# EAGLE design mainboard 1.3 (EAGLE 6.1)
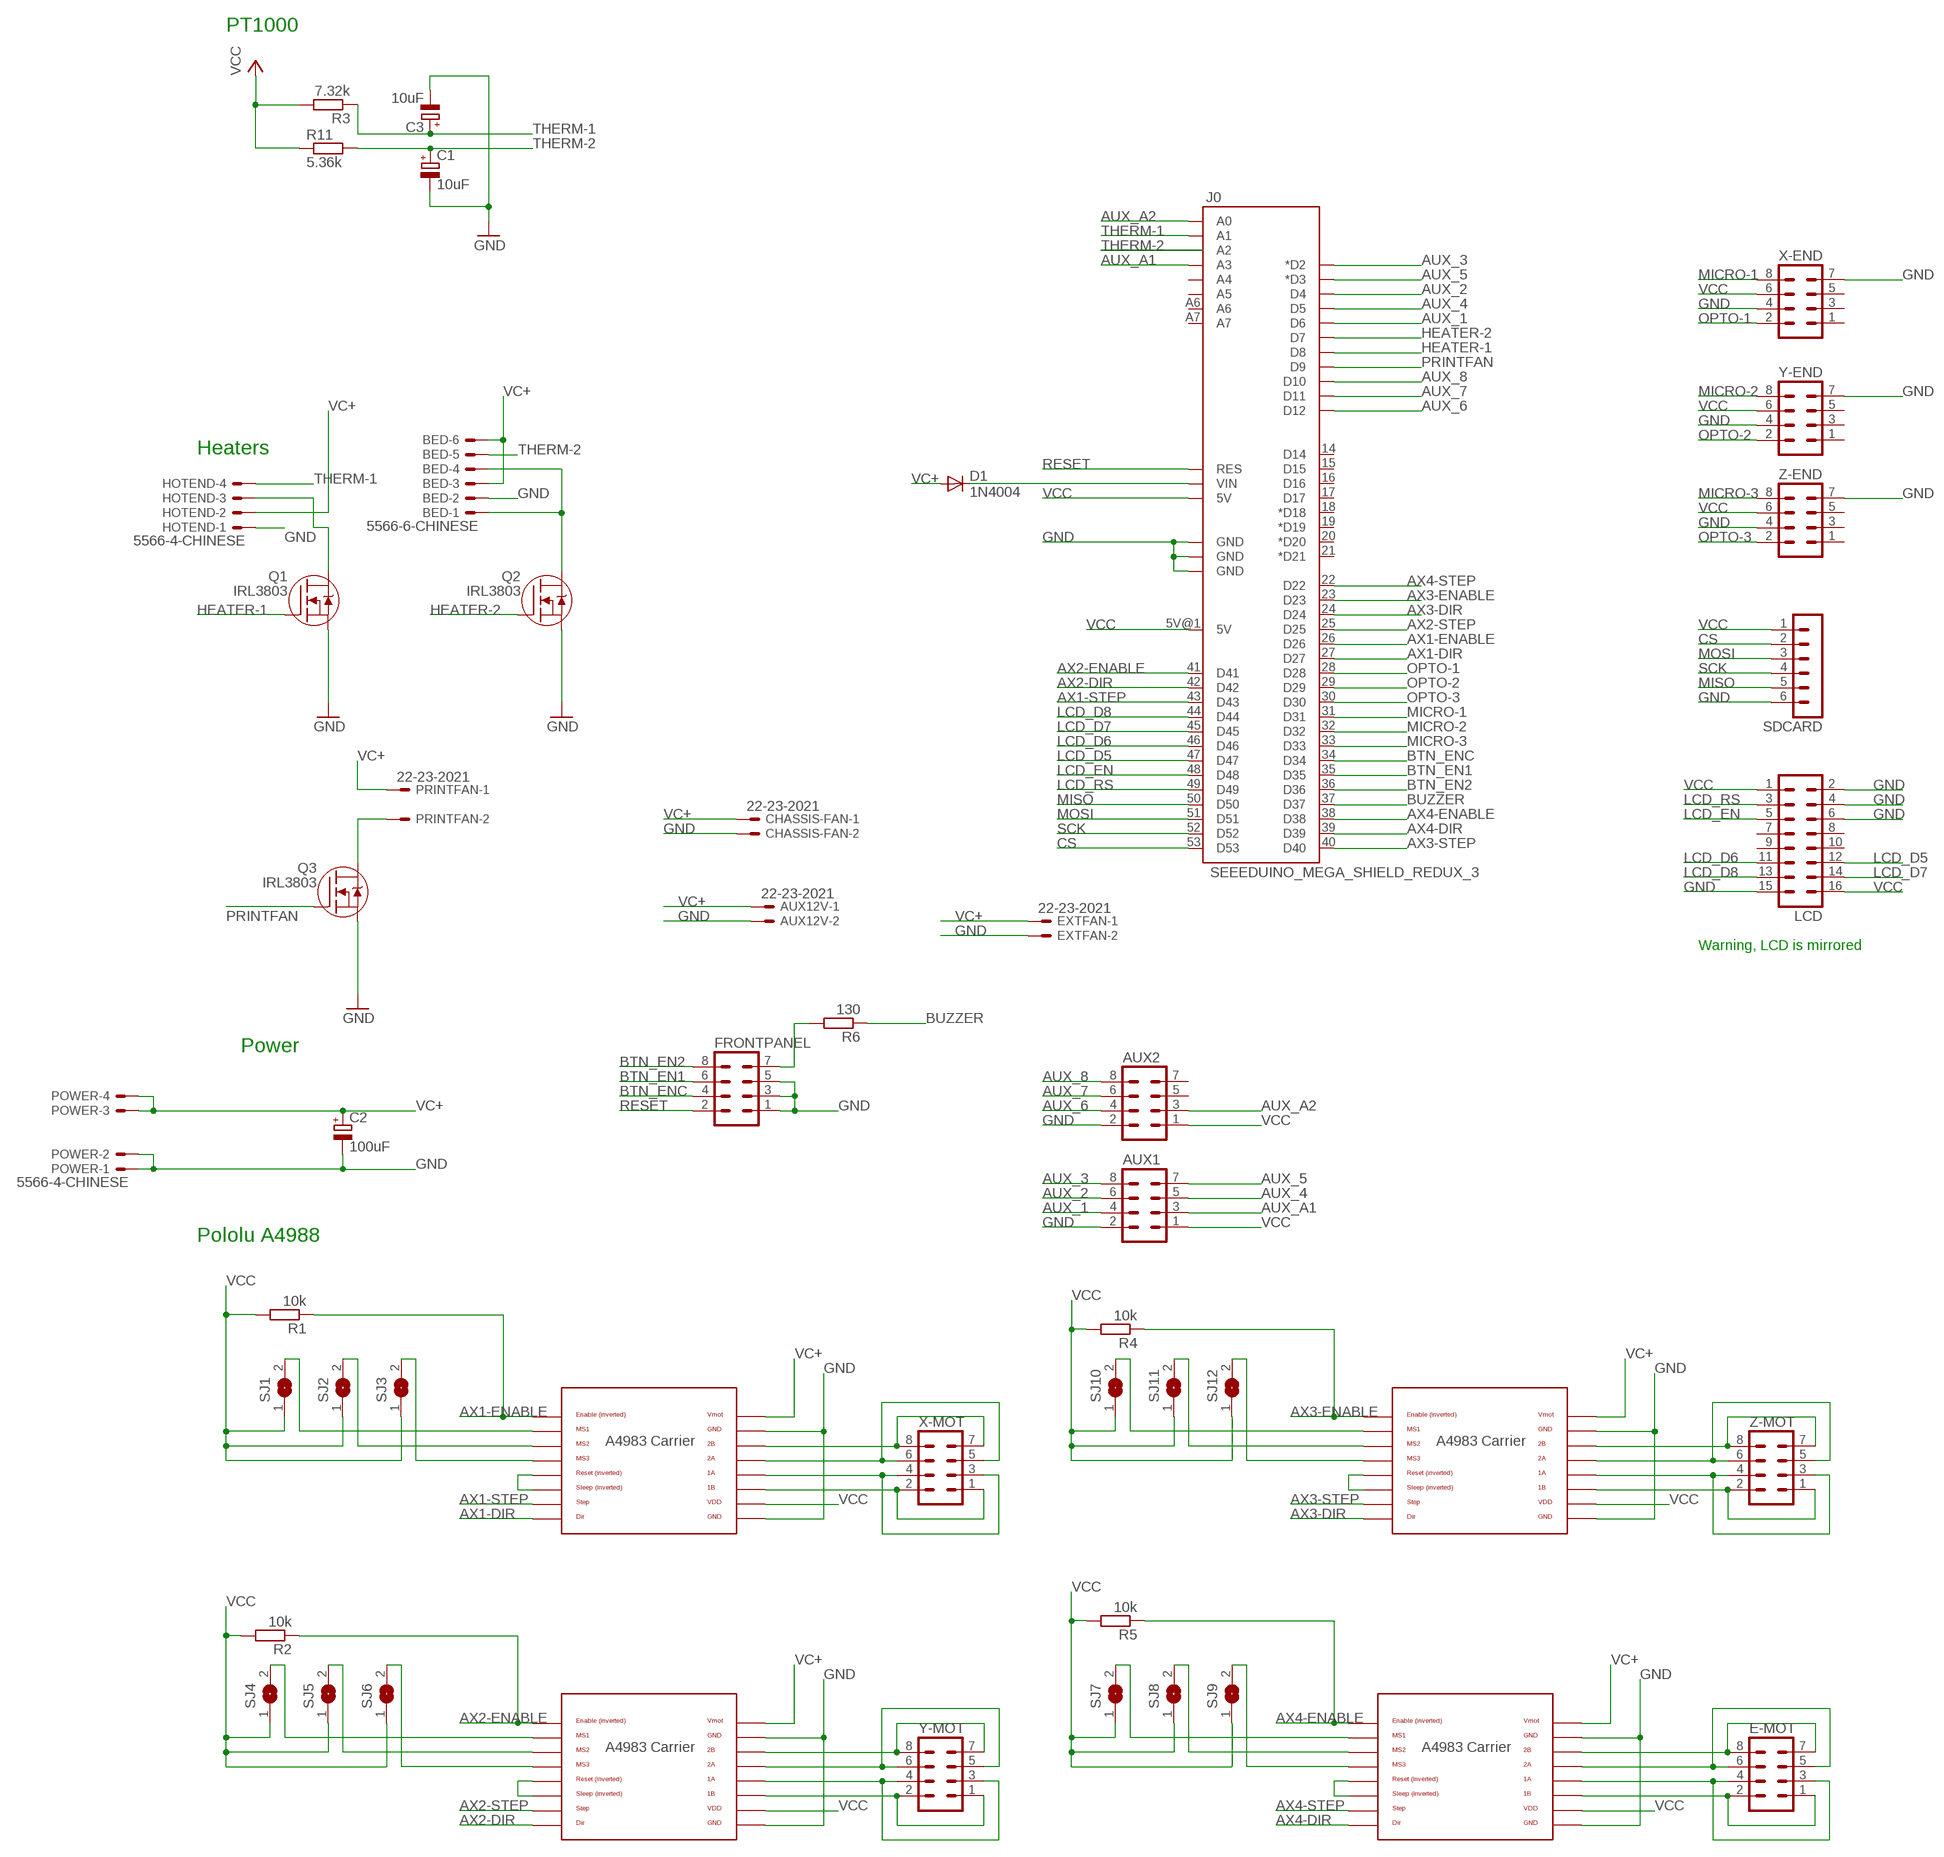
[diagram p0: schematic, sheet 1]

## Parts
AUX1  MA04-2-HOLES  [MA04-2]
AUX2  MA04-2  [MA04-2@1]
AUX12V  22-23-2021  [22-23-2021]
BED  5566-6-CHINESE  [5566-6-CHINESE]
C1  10uF  CPOL-EUE2.5-6  [E2,5-6]
C2  100uF  CPOL-EUE2.5-6  [E2,5-6]
C3  10uF  CPOL-EUE2.5-6  [E2,5-6]
CHASSIS-FAN  22-23-2021  [22-23-2021]
D1  1N4004  [DO41-10]
E-AXIS  POLOLU_A4983CARRIER  [A4983CARRIER]
E-MOT  MA04-2  [MA04-2@1]
EXTFAN  22-23-2021  [22-23-2021]
FRONTPANEL  MA04-2  [MA04-2@1]
HOTEND  5566-4-CHINESE  [5566-4-CHINESE]
J0  SEEEDUINO_MEGA_SHIELD_REDUX_3  [SEEEDUINO_MEGA_SHIELD_REDUX_3]
LCD  MA08-2  [MA08-2]
POWER  5566-4-CHINESE  [5566-4-CHINESE]
PRINTFAN  22-23-2021  [22-23-2021]
Q1  IRL3803  [TO220AB]
Q2  IRL3803  [TO220AB]
Q3  IRL3803  [TO220AB]
R1  10k  R-EU_0204/7  [0204/7]
R2  10k  R-EU_0204/7  [0204/7]
R3  7.32k  R-EU_0204/7  [0204/7]
R4  10k  R-EU_0204/7  [0204/7]
R5  10k  R-EU_0204/7  [0204/7]
R6  130  R-EU_0204/7  [0204/7]
R11  5.36k  R-EU_0204/7  [0204/7]
SDCARD  MA06-1  [MA06-1]
SJ1  SJ  [SJ]
SJ2  SJ  [SJ]
SJ3  SJ  [SJ]
SJ4  SJ  [SJ]
SJ5  SJ  [SJ]
SJ6  SJ  [SJ]
SJ7  SJ  [SJ]
SJ8  SJ  [SJ]
SJ9  SJ  [SJ]
SJ10  SJ  [SJ]
SJ11  SJ  [SJ]
SJ12  SJ  [SJ]
X-AXIS  POLOLU_A4983CARRIER  [A4983CARRIER]
X-END  MA04-2  [MA04-2@1]
X-MOT  MA04-2  [MA04-2@1]
Y-AXIS  POLOLU_A4983CARRIER  [A4983CARRIER]
Y-END  MA04-2  [MA04-2@1]
Y-MOT  MA04-2  [MA04-2@1]
Z-AXIS  POLOLU_A4983CARRIER  [A4983CARRIER]
Z-END  MA04-2  [MA04-2@1]
Z-MOT  MA04-2  [MA04-2@1]

## Nets
AUX_1: AUX1.4 J0.6(D6)
AUX_2: AUX1.6 J0.4(D4)
AUX_3: AUX1.8 J0.2(*D2)
AUX_4: AUX1.5 J0.5(D5)
AUX_5: AUX1.7 J0.3(*D3)
AUX_6: AUX2.4 J0.12(D12)
AUX_7: AUX2.6 J0.11(D11)
AUX_8: AUX2.8 J0.10(D10)
AUX_A1: AUX1.3 J0.A3
AUX_A2: AUX2.3 J0.A0
AX1-DIR: J0.27(D27) X-AXIS.DIR
AX1-ENABLE: J0.26(D26) R1.1 X-AXIS.EN
AX1-STEP: J0.43(D43) X-AXIS.STEP
AX2-DIR: J0.42(D42) Y-AXIS.DIR
AX2-ENABLE: J0.41(D41) R2.1 Y-AXIS.EN
AX2-STEP: J0.25(D25) Y-AXIS.STEP
AX3-DIR: J0.24(D24) Z-AXIS.DIR
AX3-ENABLE: J0.23(D23) R4.1 Z-AXIS.EN
AX3-STEP: J0.40(D40) Z-AXIS.STEP
AX4-DIR: E-AXIS.DIR J0.39(D39)
AX4-ENABLE: E-AXIS.EN J0.38(D38) R5.1
AX4-STEP: E-AXIS.STEP J0.22(D22)
BTN_EN1: FRONTPANEL.6 J0.35(D35)
BTN_EN2: FRONTPANEL.8 J0.36(D36)
BTN_ENC: FRONTPANEL.4 J0.34(D34)
BUZZER: J0.37(D37) R6.1
CS: J0.53(D53) SDCARD.2
GND [GND]: AUX1.2 AUX2.2 AUX12V.2 BED.2 C1.- C2.- C3.- CHASSIS-FAN.2 E-AXIS.GND E-AXIS.GND@0(GND) EXTFAN.2 FRONTPANEL.1 FRONTPANEL.3 FRONTPANEL.5 HOTEND.1 J0.GND@0(GND) J0.GND@1(GND) J0.GND@2(GND) LCD.2 LCD.4 LCD.6 LCD.15 POWER.1 POWER.2 Q1.S Q2.S Q3.S SDCARD.6 X-AXIS.GND X-AXIS.GND@0(GND) X-END.4 X-END.7 Y-AXIS.GND Y-AXIS.GND@0(GND) Y-END.4 Y-END.7 Z-AXIS.GND Z-AXIS.GND@0(GND) Z-END.4 Z-END.7
HEATER-1: J0.8(D8) Q1.G
HEATER-2: J0.7(D7) Q2.G
LCD_D5: J0.47(D47) LCD.12
LCD_D6: J0.46(D46) LCD.11
LCD_D7: J0.45(D45) LCD.14
LCD_D8: J0.44(D44) LCD.13
LCD_EN: J0.48(D48) LCD.5
LCD_RS: J0.49(D49) LCD.3
MICRO-1: J0.31(D31) X-END.8
MICRO-2: J0.32(D32) Y-END.8
MICRO-3: J0.33(D33) Z-END.8
MISO: J0.50(D50) SDCARD.5
MOSI: J0.51(D51) SDCARD.3
N$1 [Heavy GND]: BED.1 BED.4 Q2.D
N$2: FRONTPANEL.7 R6.2
N$3: X-AXIS.RST X-AXIS.SLP(SLEEP)
N$4: SJ3.2 X-AXIS.MS3
N$5: SJ2.2 X-AXIS.MS2
N$6: SJ1.2 X-AXIS.MS1
N$7 [Motor 12V]: X-AXIS.2B X-MOT.7 X-MOT.8
N$8 [Motor 12V]: X-AXIS.2A X-MOT.5 X-MOT.6
N$9 [Motor 12V]: X-AXIS.1A X-MOT.3 X-MOT.4
N$10 [Motor 12V]: X-AXIS.1B X-MOT.1 X-MOT.2
N$11 [GND]: PRINTFAN.2 Q3.D
N$12: Z-AXIS.RST Z-AXIS.SLP(SLEEP)
N$13 [+12V]: D1.C J0.VIN
N$16: SJ12.2 Z-AXIS.MS3
N$17: SJ11.2 Z-AXIS.MS2
N$18: SJ10.2 Z-AXIS.MS1
N$19 [Motor 12V]: Z-AXIS.2B Z-MOT.7 Z-MOT.8
N$20 [Motor 12V]: Z-AXIS.2A Z-MOT.5 Z-MOT.6
N$21 [Motor 12V]: Z-AXIS.1A Z-MOT.3 Z-MOT.4
N$22 [Motor 12V]: Z-AXIS.1B Z-MOT.1 Z-MOT.2
N$24: Y-AXIS.RST Y-AXIS.SLP(SLEEP)
N$25: SJ6.2 Y-AXIS.MS3
N$26: SJ5.2 Y-AXIS.MS2
N$27: SJ4.2 Y-AXIS.MS1
N$28 [Motor 12V]: Y-AXIS.2B Y-MOT.7 Y-MOT.8
N$29 [Motor 12V]: Y-AXIS.2A Y-MOT.5 Y-MOT.6
N$30 [Motor 12V]: Y-AXIS.1A Y-MOT.3 Y-MOT.4
N$31 [Motor 12V]: Y-AXIS.1B Y-MOT.1 Y-MOT.2
N$33: E-AXIS.RST E-AXIS.SLP(SLEEP)
N$34: E-AXIS.MS3 SJ9.2
N$35: E-AXIS.MS2 SJ8.2
N$36: E-AXIS.MS1 SJ7.2
N$37 [Motor 12V]: E-AXIS.2B E-MOT.7 E-MOT.8
N$38 [Motor 12V]: E-AXIS.2A E-MOT.5 E-MOT.6
N$39 [Motor 12V]: E-AXIS.1A E-MOT.3 E-MOT.4
N$40 [Motor 12V]: E-AXIS.1B E-MOT.1 E-MOT.2
N$65 [Heavy GND]: HOTEND.3 Q1.D
OPTO-1: J0.28(D28) X-END.2
OPTO-2: J0.29(D29) Y-END.2
OPTO-3: J0.30(D30) Z-END.2
PRINTFAN: J0.9(D9) Q3.G
RESET: FRONTPANEL.2 J0.RST(RES)
SCK: J0.52(D52) SDCARD.4
THERM-1: C3.+ HOTEND.4 J0.A1 R3.1
THERM-2: BED.5 C1.+ J0.A2 R11.2
VC+ [+12V]: AUX12V.1 BED.3 BED.6 C2.+ CHASSIS-FAN.1 D1.A E-AXIS.VMOT EXTFAN.1 HOTEND.2 POWER.3 POWER.4 PRINTFAN.1 X-AXIS.VMOT Y-AXIS.VMOT Z-AXIS.VMOT
VCC [+5V]: AUX1.1 AUX2.1 E-AXIS.VDD J0.5V@0(5V) J0.5V@1(5V) LCD.1 LCD.16 R1.2 R2.2 R3.2 R4.2 R5.2 R11.1 SDCARD.1 SJ1.1 SJ2.1 SJ3.1 SJ4.1 SJ5.1 SJ6.1 SJ7.1 SJ8.1 SJ9.1 SJ10.1 SJ11.1 SJ12.1 X-AXIS.VDD X-END.6 Y-AXIS.VDD Y-END.6 Z-AXIS.VDD Z-END.6
Unconnected: AUX2.5 AUX2.7 J0.14(D14) J0.15(D15) J0.16(D16) J0.17(D17) J0.18(*D18) J0.19(*D19) J0.20(*D20) J0.21(*D21) J0.A4 J0.A5 J0.A6 J0.A7 LCD.7 LCD.8 LCD.9 LCD.10 X-END.1 X-END.3 X-END.5 Y-END.1 Y-END.3 Y-END.5 Z-END.1 Z-END.3 Z-END.5

## Notes on the sheet
- PT1000
- Heaters
- Warning, LCD is mirrored
- Power
- Pololu A4988

## Library data of the parts
AUX1 = local-lib:MA04-2-HOLES: PIN HEADER; OC_FARNELL: unknown; OC_NEWARK: unknown
AUX2 E-MOT FRONTPANEL X-END X-MOT Y-END Y-MOT Z-END Z-MOT = con-lstb:MA04-2: PIN HEADER; OC_FARNELL: unknown; OC_NEWARK: unknown
AUX12V CHASSIS-FAN EXTFAN PRINTFAN = con-molex:22-23-2021: .100" (2.54mm) Center Header - 2 Pin; MF: MOLEX; MPN: 22-23-2021; OC_FARNELL: 1462926; OC_NEWARK: 25C3832
BED = local-lib:5566-6-CHINESE: Mini FIT connector 6 pol Source: http://www.molex.com; MPN: 95566-61002; OC_FARNELL: unknown; OC_NEWARK: 22K8620
C1-C3 = rcl:CPOL-EU: POLARIZED CAPACITOR, European symbol
D1 = diode:1N4004: DIODE general purpose rectifier, 1 A
E-AXIS X-AXIS Y-AXIS Z-AXIS = RepRapjr:POLOLU_A4983CARRIER
HOTEND POWER = local-lib:5566-4-CHINESE: Mini FIT connector 4 pol Source: http://www.molex.com
J0 = local-lib:SEEEDUINO_MEGA_SHIELD_REDUX_3
LCD = con-lstb:MA08-2: PIN HEADER; OC_FARNELL: unknown; OC_NEWARK: unknown
Q1-Q3 = local-lib:IRL3803
R1-R6 R11 = rcl:R-EU_: RESISTOR, European symbol
SDCARD = con-lstb:MA06-1: PIN HEADER; OC_FARNELL: unknown; OC_NEWARK: unknown
SJ1-SJ12 = jumper:SJ: SMD solder JUMPER

## Net classes
0 default: width 0.24 mm
1 +5V: width 0.406 mm
2 +12V: width 0.813 mm
3 GND: width 0.406 mm
4 Motor 12V: width 0.813 mm
5 Heavy GND: width 2.54 mm

## Board
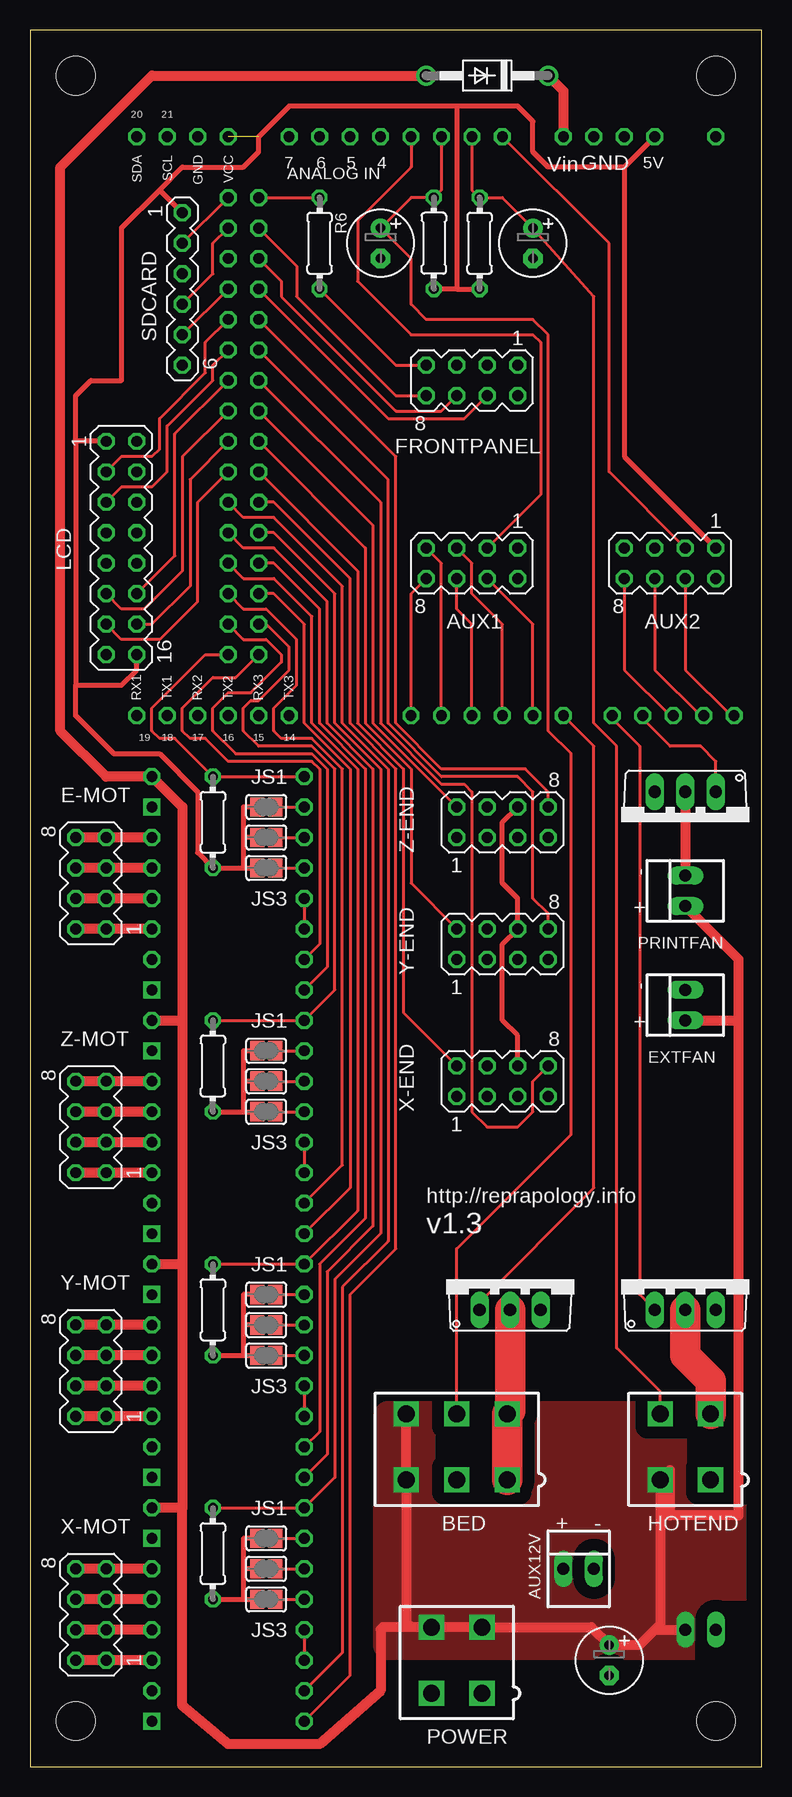
[diagram p1: board, top side]
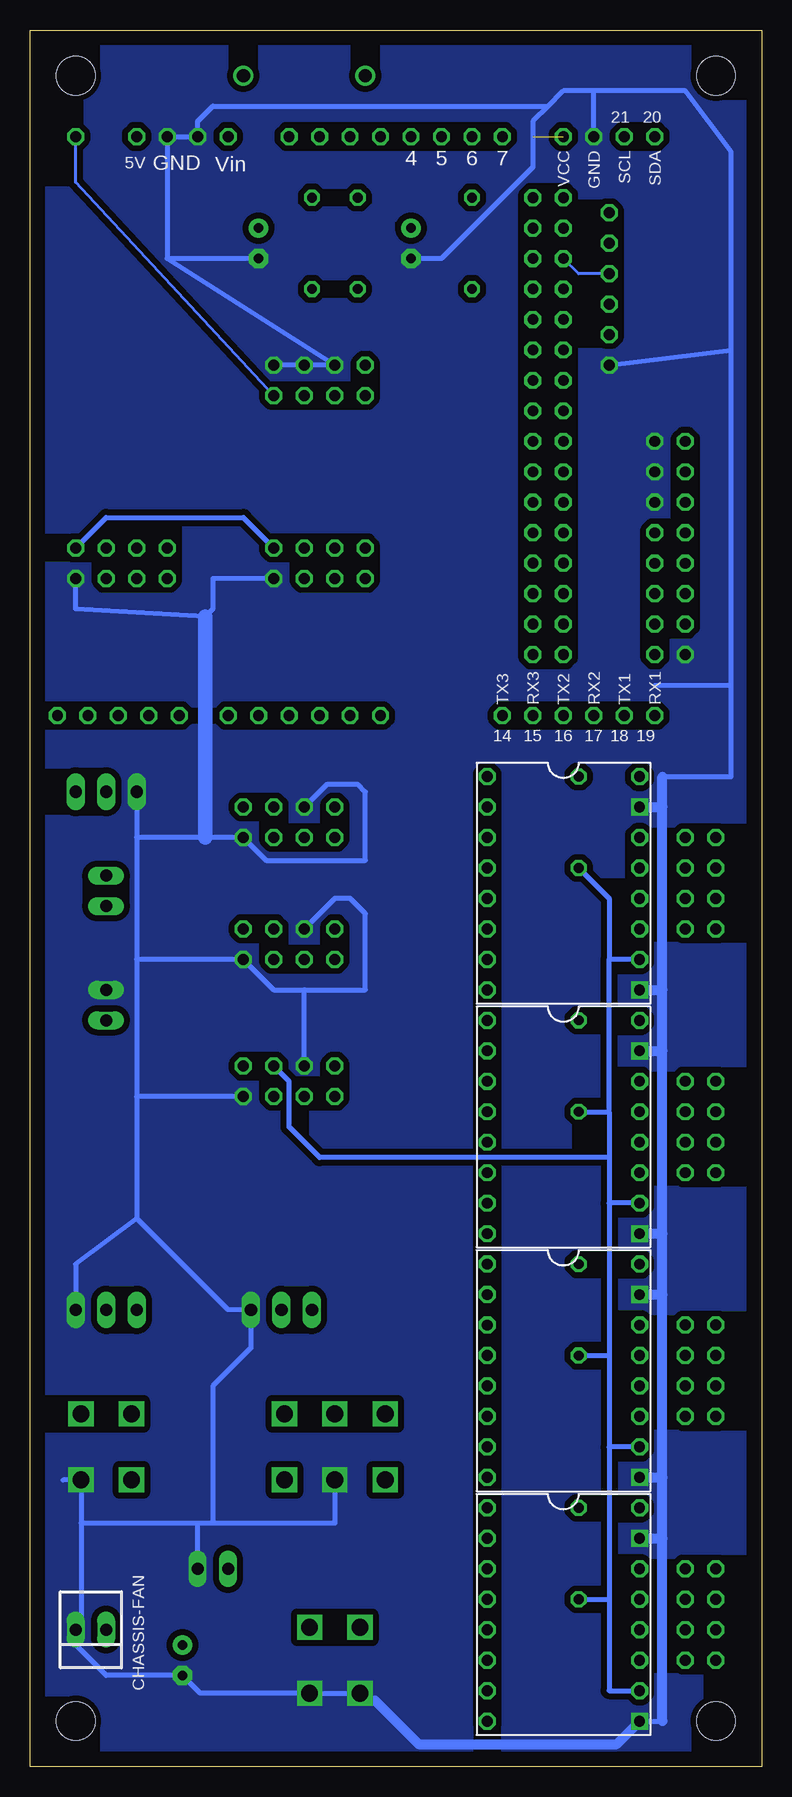
[diagram p2: board, bottom side, seen from below]

Size 60.96 x 144.78 mm. Coordinates in mm from the lower left corner, seen from the top.
Outline: 60.96,0 60.96,144.78 0,144.78 0,0 60.96,0
Copper layers (1*16): Top 0.018mm / dielectric 1.5mm / Bottom 0.018mm
Design rules: minimum track width 0.15mm, minimum drill 0.6mm, track to track 0.15mm, track to pad 0.15mm, pad to pad 0.15mm, via to via 0.15mm, smd to smd 0.15mm, copper to edge 0.3mm, drill to drill 8mil, minimum pad ring 10mil, minimum via ring 8mil, stop-mask expansion 0.1mm, vias tented up to drill 0mil, thermal gap 10mil
Holes 3.2 mm at 3.81,3.81 57.15,3.81 57.15,140.97 3.81,140.97

### Footprints (pad centres in the part's own frame; a part is rotated, then mirrored left to right if it is on the bottom)
MA04-2 = drill 0.9 octagon: 1 -3.81,-1.27; 2 -3.81,1.27; 3 -1.27,-1.27; 4 -1.27,1.27; 5 1.27,-1.27; 6 1.27,1.27; 7 3.81,-1.27; 8 3.81,1.27
22-23-2021 = drill 1 long: 1 -1.27,0; 2 1.27,0
5566-6-CHINESE = drill 1.4 square: 1 4.2,-2.75; 2 0,-2.75; 3 -4.2,-2.75; 4 4.2,2.75; 5 0,2.75; 6 -4.2,2.75
E2,5-6 = drill 0.813 pad 1.6: + -1.27,0 | drill 0.813 pad 1.6 octagon: - 1.27,0
DO41-10 = drill 1.118: A 5.08,0; C -5.08,0
A4983CARRIER = drill 0.9 octagon: 1A 8.89,1.27; 1B 11.43,1.27; 2A 6.35,1.27; 2B 3.81,1.27; DIR 16.51,-11.43; EN -1.27,-11.43; MS1 1.27,-11.43; MS2 3.81,-11.43; MS3 6.35,-11.43; RST 8.89,-11.43; SLP 11.43,-11.43; STEP 13.97,-11.43; VDD 13.97,1.27; VMOT -1.27,1.27 | drill 0.9 square: GND 16.51,1.27; GND@0 1.27,1.27
5566-4-CHINESE = drill 1.4 square: 1 2.1,-2.75; 2 -2.1,-2.75; 3 2.1,2.75; 4 -2.1,2.75
SEEEDUINO_MEGA_SHIELD_REDUX_3 = drill 0.9 octagon: 2 44.45,50.8; 3 41.91,50.8; 4 39.37,50.8; 5 36.83,50.8; 5V@0 24.13,2.54; 5V@1 59.69,2.54; 6 34.29,50.8; 7 31.75,50.8; 8 27.686,50.8; 9 25.146,50.8; 10 22.606,50.8; 11 20.066,50.8; 12 17.526,50.8; 14 54.61,50.8; 15 57.15,50.8; 16 59.69,50.8; 17 62.23,50.8; 18 64.77,50.8; 19 67.31,50.8; 20 67.31,2.54; 21 64.77,2.54; 22 57.15,45.72; 23 57.15,43.18; 24 57.15,40.64; 25 57.15,38.1; 26 57.15,35.56; 27 57.15,33.02; 28 57.15,30.48; 29 57.15,27.94; 30 57.15,25.4; 31 57.15,22.86; 32 57.15,20.32; 33 57.15,17.78; 34 57.15,15.24; 35 57.15,12.7; 36 57.15,10.16; 37 57.15,7.62; 38 59.69,45.72; 39 59.69,43.18; 40 59.69,40.64; 41 59.69,38.1; 42 59.69,35.56; 43 59.69,33.02; 44 59.69,30.48; 45 59.69,27.94; 46 59.69,25.4; 47 59.69,22.86; 48 59.69,20.32; 49 59.69,17.78; 50 59.69,15.24; 51 59.69,12.7; 52 59.69,10.16; 53 59.69,7.62; A0 36.83,2.54; A1 39.37,2.54; A2 41.91,2.54; A3 44.45,2.54; A4 46.99,2.54; A5 49.53,2.54; A6 52.07,2.54; A7 54.61,2.54; GND@0 26.67,2.54; GND@1 29.21,2.54; GND@2 62.23,2.54; RST 19.05,2.54; VIN 31.75,2.54
MA08-2 = drill 0.9 octagon: 1 -8.89,-1.27; 2 -8.89,1.27; 3 -6.35,-1.27; 4 -6.35,1.27; 5 -3.81,-1.27; 6 -3.81,1.27; 7 -1.27,-1.27; 8 -1.27,1.27; 9 1.27,-1.27; 10 1.27,1.27; 11 3.81,-1.27; 12 3.81,1.27; 13 6.35,-1.27; 14 6.35,1.27; 15 8.89,-1.27; 16 8.89,1.27
TO220AB = drill 1.016 long: D 0,0; G -2.54,0; S 2.54,0
0204/7 = drill 0.813 octagon: 1 -3.81,0; 2 3.81,0
MA06-1 = drill 0.9 octagon: 1 -6.35,0; 2 -3.81,0; 3 -1.27,0; 4 1.27,0; 5 3.81,0; 6 6.35,0
SJ = smd 1.168 x 1.6: 1 -0.762,0; 2 0.762,0

### Placement (x,y rotation side)
AUX1  36.83,100.33 180 top
AUX2  [MA04-2]  53.34,100.33 180 top
AUX12V  45.72,16.51 0 top
BED  35.56,26.67 0 top
C1  29.21,127 270 top
C2  48.26,8.89 270 top
C3  41.91,127 270 top
CHASSIS-FAN  55.88,11.43 180 bottom
D1  38.1,140.97 180 top
E-AXIS  11.43,81.28 270 bottom
E-MOT  [MA04-2]  5.08,73.66 90 top
EXTFAN  54.61,63.5 90 top
FRONTPANEL  [MA04-2]  36.83,115.57 180 top
HOTEND  54.61,26.67 0 top
J0  76.2,138.43 180 top
LCD  7.62,101.6 270 top
POWER  35.56,8.89 0 top
PRINTFAN  54.61,73.03 90 top
Q1  54.61,38.1 0 top
Q2  40.01,38.1 0 top
Q3  54.61,81.28 180 top
R1  15.24,17.78 270 top
R2  15.24,38.1 270 top
R3  37.47,127 270 top
R4  15.24,58.42 270 top
R5  15.24,78.74 270 top
R6  24.13,127 270 top
R11  33.66,127 90 top
SDCARD  12.7,123.19 270 top
SJ1  19.68,19.05 0 top
SJ2  19.68,16.51 0 top
SJ3  19.68,13.97 0 top
SJ4  19.68,39.37 0 top
SJ5  19.68,36.83 0 top
SJ6  19.68,34.29 0 top
SJ7  19.68,80.01 0 top
SJ8  19.68,77.47 0 top
SJ9  19.68,74.93 0 top
SJ10  19.68,59.69 0 top
SJ11  19.68,57.15 0 top
SJ12  19.68,54.61 0 top
X-AXIS  11.43,20.32 270 bottom
X-END  [MA04-2]  39.37,57.15 0 top
X-MOT  [MA04-2]  5.08,12.7 90 top
Y-AXIS  11.43,40.64 270 bottom
Y-END  [MA04-2]  39.37,68.58 0 top
Y-MOT  [MA04-2]  5.08,33.02 90 top
Z-AXIS  11.43,60.96 270 bottom
Z-END  [MA04-2]  39.37,78.74 0 top
Z-MOT  [MA04-2]  5.08,53.34 90 top

### Tracks (layer width: path | path; a pad name or v marks a point on that pad's centre or on a via)
AUX_1
  Top 0.24: J0.6 41.91,95.25 AUX1.4
AUX_2
  Top 0.24: J0.4 36.83,95.25 35.56,96.52 AUX1.6
AUX_3
  Top 0.24: J0.2 31.75,97.79 AUX1.8
AUX_4
  Top 0.24: J0.5 39.37,95.25 36.83,97.79 36.83,100.33 AUX1.5
AUX_5
  Top 0.24: J0.3 34.29,100.33 AUX1.7
AUX_6
  Top 0.24: AUX2.4 54.61,91.44 58.42,87.63 J0.12
AUX_7
  Top 0.24: AUX2.6 52.07,91.44 55.88,87.63 J0.11
AUX_8
  Top 0.24: AUX2.8 49.53,91.44 53.34,87.63 J0.10
AUX_A1
  Top 0.24: J0.A3 31.75,133.35 27.3,128.91 27.3,123.83 31.75,119.38 41.91,119.38 42.55,118.75 42.55,106.05 AUX1.3
AUX_A2
  Top 0.24: J0.A0 48.26,127 48.26,107.95 AUX2.3
AX1-DIR
  Top 0.24: X-AXIS.DIR 26.67,7.62 26.67,39.37 30.48,43.18 30.48,83.19 26.67,87 26.67,99.06 20.32,105.41 J0.27
AX1-ENABLE
  Top 0.24: R1.1 X-AXIS.EN 25.4,24.13 25.4,40.64 29.21,44.45 29.21,83.19 25.4,87 25.4,97.79 20.32,102.87 J0.26
AX1-STEP
  Top 0.24: X-AXIS.STEP 26.04,9.53 26.04,40.01 29.84,43.81 29.84,83.19 26.04,87 26.04,98.42 20.32,104.14 17.78,104.14 J0.43
AX2-DIR
  Top 0.24: Y-AXIS.DIR 24.77,26.04 24.77,41.27 28.57,45.09 28.57,83.19 24.77,87 24.77,97.16 20.32,101.6 17.78,101.6 J0.42
AX2-ENABLE
  Top 0.24: R2.1 Y-AXIS.EN 27.3,46.35 27.3,83.19 23.5,87 23.5,95.89 20.32,99.06 17.78,99.06 J0.41
AX2-STEP
  Top 0.24: Y-AXIS.STEP 24.13,27.94 24.13,41.91 27.94,45.72 27.94,83.19 24.13,87 24.13,96.52 20.32,100.33 J0.25
AX3-DIR
  Top 0.24: Z-AXIS.DIR 26.67,48.26 26.67,83.19 22.86,87 22.86,95.25 20.32,97.79 J0.24
AX3-ENABLE
  Top 0.24: R4.1 Z-AXIS.EN 25.4,64.77 25.4,83.19 23.5,85.09 19.05,85.09 17.78,86.36 17.78,88.27 18.41,88.9 19.05,88.9 21.59,91.44 21.59,93.34 19.68,95.25 J0.23
AX3-STEP
  Top 0.24: Z-AXIS.STEP 26.04,50.16 26.04,83.19 23.5,85.72 20.95,85.72 20.32,86.36 20.32,88.27 22.23,90.17 22.23,93.98 19.68,96.52 17.78,96.52 J0.40
AX4-DIR
  Top 0.24: J0.39 17.78,93.98 19.68,93.98 20.95,92.71 20.95,92.08 18.41,89.53 16.51,89.53 15.24,88.27 15.24,86.36 17.14,84.45 23.5,84.45 24.77,83.19 24.77,66.67 E-AXIS.DIR
AX4-ENABLE
  Top 0.24: E-AXIS.EN R5.1 12.06,85.72 10.79,85.72 10.16,86.36 10.16,88.27 14.61,92.71 J0.38
AX4-STEP
  Top 0.24: E-AXIS.STEP 24.13,68.58 24.13,83.19 23.5,83.82 16.51,83.82 14.61,85.72 13.34,85.72 12.7,86.36 12.7,88.27 15.24,90.81 17.14,90.81 J0.22
BTN_EN1
  Top 0.24: J0.35 20.95,123.83 20.95,122.56 30.48,113.03 34.29,113.03 FRONTPANEL.6
BTN_EN2
  Top 0.24: J0.36 22.23,125.09 22.23,122.56 30.48,114.3 FRONTPANEL.8
BTN_ENC
  Top 0.24: J0.34 29.84,112.39 36.2,112.39 FRONTPANEL.4
BUZZER
  Top 0.24: J0.37 R6.1
CS
  Top 0.24: SDCARD.2 J0.53
GND
  Bottom 0.406: 32.19,5.52 POWER.2 POWER.1 46.78,6.14 C2.- 54.61,7.62 57.15,10.16 CHASSIS-FAN.2 56.71,11.87 56.71,20.32 | 8.26,82.55 2.54,82.55 2.54,90.17 | 2.54,90.17 2.54,118.11 | 2.54,118.11 2.54,134.62 6.35,139.7 13.97,139.7 | 13.97,139.7 16.51,139.7 17.78,138.43 | 17.78,138.43 19.05,137.16 19.05,133.35 26.67,125.73 C1.- | X-AXIS.GND 8.26,3.81 | 58.21,23.92 HOTEND.1 56.71,20.32 | Q3.S 52.07,77.47 | 52.07,77.47 52.07,67.31 | 52.07,67.31 52.07,55.88 | 52.07,55.88 52.07,45.72 | 52.07,45.72 57.15,41.91 Q1.S | BED.2 35.56,20.32 45.72,20.32 | 45.72,20.32 46.99,20.32 | 46.99,20.32 56.71,20.32 | 45.72,20.32 45.72,31.75 42.55,34.92 Q2.S 44.45,38.1 52.07,45.72 | X-END.7 52.07,55.88 | 52.07,67.31 Y-END.7 40.64,64.77 38.1,64.77 | 52.07,77.47 46.35,77.47 Z-END.7 41.27,75.56 33.02,75.56 33.02,81.28 33.66,81.92 36.2,81.92 Z-END.4 | 17.78,138.43 45.72,138.43 46.99,137.16 J0.GND@1 J0.GND@0 49.53,125.73 | J0.GND@2 13.97,139.7 | FRONTPANEL.1 FRONTPANEL.3 FRONTPANEL.5 49.53,125.73 | C3.- 49.53,125.73 | SDCARD.6 2.54,118.11 | 38.1,64.77 33.02,64.77 33.02,71.12 34.29,72.39 35.56,72.39 Y-END.4 | X-END.4 38.1,64.77 | AUX12V.2 46.99,20.32 | AUX1.2 45.72,99.06 45.72,96.52 46.35,95.89 57.15,96.52 AUX2.2 | 8.89,90.17 2.54,90.17
  Bottom 0.813: 8.26,3.81 8.26,19.05 | 8.26,19.05 8.26,24.13 | 8.26,24.13 8.26,39.37 | 8.26,39.37 8.26,44.45 | 8.26,44.45 8.26,59.69 | 8.26,59.69 8.26,64.77 | 8.26,64.77 8.26,80.01 | 8.26,80.01 8.26,82.55 | E-AXIS.GND 8.26,64.77 | Z-AXIS.GND 8.26,44.45 | Y-AXIS.GND 8.26,24.13 | X-AXIS.GND@0 8.26,19.05 | Y-AXIS.GND@0 8.26,39.37 | Z-AXIS.GND@0 8.26,59.69 | E-AXIS.GND@0 8.26,80.01 | 32.19,5.52 28.57,1.91 12.06,1.91 X-AXIS.GND
  Bottom 1.2: 46.35,95.89 46.35,77.47
  pour Bottom (isolate 0.5, no thermals): 2.54,142.24 58.42,142.24 58.42,2.54 2.54,2.54
HEATER-1
  Top 0.24: J0.8 48.51,87.38 50.8,85.09 50.8,39.37 Q1.G
HEATER-2
  Top 0.24: Q2.G 37.47,38.73 46.99,48.26 46.99,85.09 J0.7
LCD_D5
  Top 0.24: LCD.12 12.06,100.97 12.06,111.12 J0.47
LCD_D6
  Top 0.24: J0.46 12.7,109.22 12.7,99.69 9.53,96.52 7.62,96.52 LCD.11
LCD_D7
  Top 0.24: J0.45 13.34,107.31 13.34,98.42 10.16,95.25 LCD.14
LCD_D8
  Top 0.24: J0.44 13.97,105.41 13.97,97.16 10.79,93.98 7.62,93.98 LCD.13
LCD_EN
  Top 0.24: J0.48 15.24,116.84 15.24,115.57 11.43,111.76 11.43,107.95 10.16,106.68 7.62,106.68 LCD.5
LCD_RS
  Top 0.24: J0.49 14.61,118.75 14.61,116.2 10.79,112.39 10.79,109.86 10.16,109.22 7.62,109.22 LCD.3
MICRO-1
  Top 0.24: X-END.8 41.91,57.15 41.91,54.61 40.64,53.34 38.1,53.34 36.83,54.61 36.83,81.28 36.2,81.92 34.29,81.92 29.21,87 29.21,105.41 J0.31
MICRO-2
  Top 0.24: Y-END.8 43.18,71.12 41.91,72.39 41.91,81.28 40.64,82.55 34.29,82.55 29.84,87 29.84,107.31 J0.32
MICRO-3
  Top 0.24: Z-END.8 43.18,81.28 41.27,83.19 34.29,83.19 30.48,87 30.48,109.22 J0.33
MISO
  Top 0.24: SDCARD.5 J0.50
MOSI
  Bottom 0.24: SDCARD.3 15.24,124.46 J0.51
N$1
  Top 2.54: Q2.D 40.01,29.66 BED.4 BED.1
N$2
  Top 0.24: R6.2 30.48,116.84 FRONTPANEL.7
N$3
  Top 0.24: X-AXIS.RST X-AXIS.SLP
N$4
  Top 0.24: SJ3.2 X-AXIS.MS3
N$5
  Top 0.24: SJ2.2 X-AXIS.MS2
N$6
  Top 0.24: SJ1.2 X-AXIS.MS1
N$7
  Top 0.813: X-AXIS.2B X-MOT.7 X-MOT.8
N$8
  Top 0.813: X-AXIS.2A X-MOT.5 X-MOT.6
N$9
  Top 0.813: X-AXIS.1A X-MOT.3 X-MOT.4
N$10
  Top 0.813: X-AXIS.1B X-MOT.1 X-MOT.2
N$11
  Top 0.813: Q3.D PRINTFAN.2
N$12
  Top 0.24: Z-AXIS.RST Z-AXIS.SLP
N$13
  Top 0.813: D1.C 44.45,139.7 J0.VIN
N$16
  Top 0.24: SJ12.2 Z-AXIS.MS3
N$17
  Top 0.24: SJ11.2 Z-AXIS.MS2
N$18
  Top 0.24: SJ10.2 Z-AXIS.MS1
N$19
  Top 0.813: Z-AXIS.2B Z-MOT.7 Z-MOT.8
N$20
  Top 0.813: Z-AXIS.2A Z-MOT.5 Z-MOT.6
N$21
  Top 0.813: Z-AXIS.1A Z-MOT.3 Z-MOT.4
N$22
  Top 0.813: Z-AXIS.1B Z-MOT.1 Z-MOT.2
N$24
  Top 0.24: Y-AXIS.RST Y-AXIS.SLP
N$25
  Top 0.24: SJ6.2 Y-AXIS.MS3
N$26
  Top 0.24: SJ5.2 Y-AXIS.MS2
N$27
  Top 0.24: SJ4.2 Y-AXIS.MS1
N$28
  Top 0.813: Y-AXIS.2B Y-MOT.7 Y-MOT.8
N$29
  Top 0.813: Y-AXIS.2A Y-MOT.5 Y-MOT.6
N$30
  Top 0.813: Y-AXIS.1A Y-MOT.3 Y-MOT.4
N$31
  Top 0.813: Y-AXIS.1B Y-MOT.1 Y-MOT.2
N$33
  Top 0.24: E-AXIS.RST E-AXIS.SLP
N$34
  Top 0.24: SJ9.2 E-AXIS.MS3
N$35
  Top 0.24: SJ8.2 E-AXIS.MS2
N$36
  Top 0.24: SJ7.2 E-AXIS.MS1
N$37
  Top 0.813: E-AXIS.2B E-MOT.7 E-MOT.8
N$38
  Top 0.813: E-AXIS.2A E-MOT.5 E-MOT.6
N$39
  Top 0.813: E-AXIS.1A E-MOT.3 E-MOT.4
N$40
  Top 0.813: E-AXIS.1B E-MOT.1 E-MOT.2
N$65
  Top 2.54: HOTEND.3 56.71,32.19 54.61,34.29 Q1.D
OPTO-1
  Top 0.24: X-END.2 31.11,62.87 31.11,83.19 27.3,87 27.3,99.69 J0.28
OPTO-2
  Top 0.24: Y-END.2 31.75,73.66 31.75,83.19 27.94,87 27.94,101.6 J0.29
OPTO-3
  Top 0.24: Z-END.2 28.57,87 28.57,103.5 J0.30
PRINTFAN
  Top 0.24: J0.9 51.05,87.38 53.34,85.09 55.88,85.09 57.15,83.82 Q3.G
RESET
  Bottom 0.24: FRONTPANEL.2 57.15,132.08 J0.RST
SCK
  Top 0.24: SDCARD.4 15.24,124.46 15.24,127 J0.52
THERM-1
  Top 0.24: HOTEND.4 52.51,31.31 48.9,34.92 48.9,85.09 46.99,87 46.99,122.56 C3.+ 39.37,130.81 R3.1 36.83,131.44 J0.A1
THERM-2
  Top 0.24: BED.5 35.56,43.18 45.09,52.7 45.09,84.45 43.18,86.36 43.18,119.38 41.91,120.65 33.02,120.65 31.75,121.92 31.75,125.73 C1.+ 31.75,130.81 R11.2 34.29,131.44 J0.A2
VC+
  Top 0.813: 31.75,11.64 POWER.4 POWER.3 46.78,11.64 C2.+ 50.8,10.16 52.07,11.43 | 31.75,11.64 29.42,11.64 29.21,11.43 29.21,6.35 24.13,1.91 16.51,1.91 12.7,5.08 12.7,21.59 | 12.7,21.59 X-AXIS.VMOT | Y-AXIS.VMOT 12.7,41.91 | 12.7,41.91 12.7,21.59 | Z-AXIS.VMOT 12.7,62.23 | 12.7,62.23 12.7,41.91 | 12.7,62.23 12.7,80.01 E-AXIS.VMOT 6.35,82.55 2.54,86.36 2.54,133.35 10.16,140.97 D1.A | 52.07,11.43 CHASSIS-FAN.1 | 52.07,11.43 52.51,11.87 HOTEND.2 53.34,24.75 53.34,20.95 59.05,20.95 59.05,62.23 | 31.75,11.64 31.36,12.03 BED.3 BED.6 | 59.05,62.23 59.05,67.31 PRINTFAN.1 | EXTFAN.1 59.05,62.23
  pour Top (isolate 1, no thermals): 29.84,29.21 58.42,29.21 58.42,10.16 29.84,10.16
VCC  (1 unrouted)
  Top 0.406: 17.78,74.93 R5.2 13.97,76.2 13.97,81.28 10.79,84.45 6.99,84.45 3.81,87.63 3.81,90.17 | 17.78,74.93 18.41,74.93 | 18.41,74.93 SJ9.1 | R1.2 17.78,13.97 | 35.56,138.43 21.59,138.43 19.05,135.89 19.05,134.62 17.78,133.35 12.7,133.35 10.79,131.44 | 3.81,110.49 3.81,90.17 | 19.05,80.14 SJ7.1 17.78,80.01 17.78,77.47 | 35.56,123.19 R11.1 | 35.56,138.43 35.56,123.19 | 35.56,123.19 R3.2 | R4.2 17.78,54.61 | 17.78,54.61 SJ12.1 | R2.2 17.78,34.29 | 17.78,34.29 SJ6.1 | 18.92,75.44 18.41,74.93 | 18.41,57.15 SJ11.1 17.78,57.15 | SJ2.1 17.78,16.51 | 17.78,16.51 17.78,13.97 | 17.78,13.97 SJ3.1 | SJ1.1 17.78,19.05 17.78,16.51 | SJ5.1 17.78,36.83 | 17.78,36.83 17.78,34.29 | SJ4.1 17.78,39.37 17.78,36.83 | 17.78,57.15 17.78,54.61 | SJ10.1 17.78,59.69 17.78,57.15 | SJ8.1 17.78,77.47 | 17.78,77.47 17.78,74.93 | J0.5V@0 49.53,133.35 | 49.53,133.35 43.18,133.35 41.91,134.62 41.91,137.16 40.64,138.43 35.56,138.43 | X-END.6 40.64,60.96 39.37,62.23 39.37,68.58 Y-END.6 40.64,72.39 39.37,73.66 39.37,78.74 Z-END.6 | AUX2.1 49.53,109.22 49.53,133.35 | 10.79,131.44 7.62,128.27 7.62,115.57 5.08,115.57 3.81,114.3 3.81,110.49 | SDCARD.1 10.79,131.44 | LCD.1 3.81,110.49 | 3.81,90.17 7.62,90.17 8.89,91.44 LCD.16
  Bottom 0.406: E-AXIS.VDD 12.7,67.31 | 12.7,54.61 12.7,50.8 | 12.7,50.8 12.7,46.99 | Z-AXIS.VDD 12.7,46.99 | 12.7,46.99 12.7,34.29 | Y-AXIS.VDD 12.7,26.67 | 12.7,26.67 12.7,13.97 | 12.7,13.97 12.7,6.35 X-AXIS.VDD | R1.2 12.7,13.97 | R5.2 12.7,72.39 12.7,67.31 | 12.7,54.61 12.7,67.31 | R2.2 12.7,34.29 | 12.7,34.29 12.7,26.67 | R4.2 12.7,54.61 | 12.7,50.8 36.83,50.8 39.37,53.34 39.37,57.15 X-END.6 | AUX1.1 43.18,104.14 54.61,104.14 AUX2.1

### Text on the board
tNames: JS1 | - | JS3 | + | - | JS1 | + | JS3 | http://reprapology.info | v1.3 | JS1 | JS3 | JS1 | + | - | JS3